# EAGLE design Vario Kobo (EAGLE 7.3.0)

## Sheet 1 of 2: Alimentation
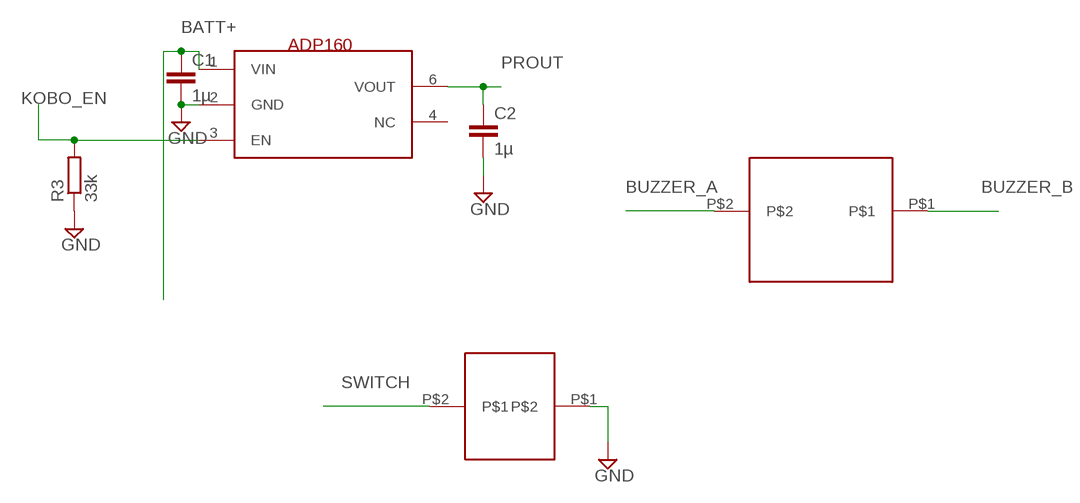
[diagram p0: schematic, sheet 1]

### Parts
ADP160  ADP160/161/162/163  [TSOT23-6_DDC]
BUTTON  SMS_J_LEAD  [SMS_J_LEAD]
BUZZER  PKLCS1212E2000-R1  [PKLCS1212E2000-R1-SMD]
C1  1µ  C-EUC0603  [C0603]
C2  1µ  C-EUC0603  [C0603]
R3  33k  R-EU_R0603  [R0603]

### Nets
BATT+: ADP160.1(VIN) C1.1 ; also sheet 2
BUZZER_A: BUZZER.P$2 ; also sheet 2
BUZZER_B: BUZZER.P$1 ; also sheet 2
GND: ADP160.2(GND) BUTTON.P$1 C1.2 C2.2 R3.1 ; also sheet 2
KOBO_EN: ADP160.3(EN) R3.2 ; also sheet 2
PROUT: ADP160.6(VOUT) C2.1 ; also sheet 2
SWITCH: BUTTON.P$2 ; also sheet 2
Unconnected: ADP160.4(NC)

## Sheet 2 of 2: Vario Core
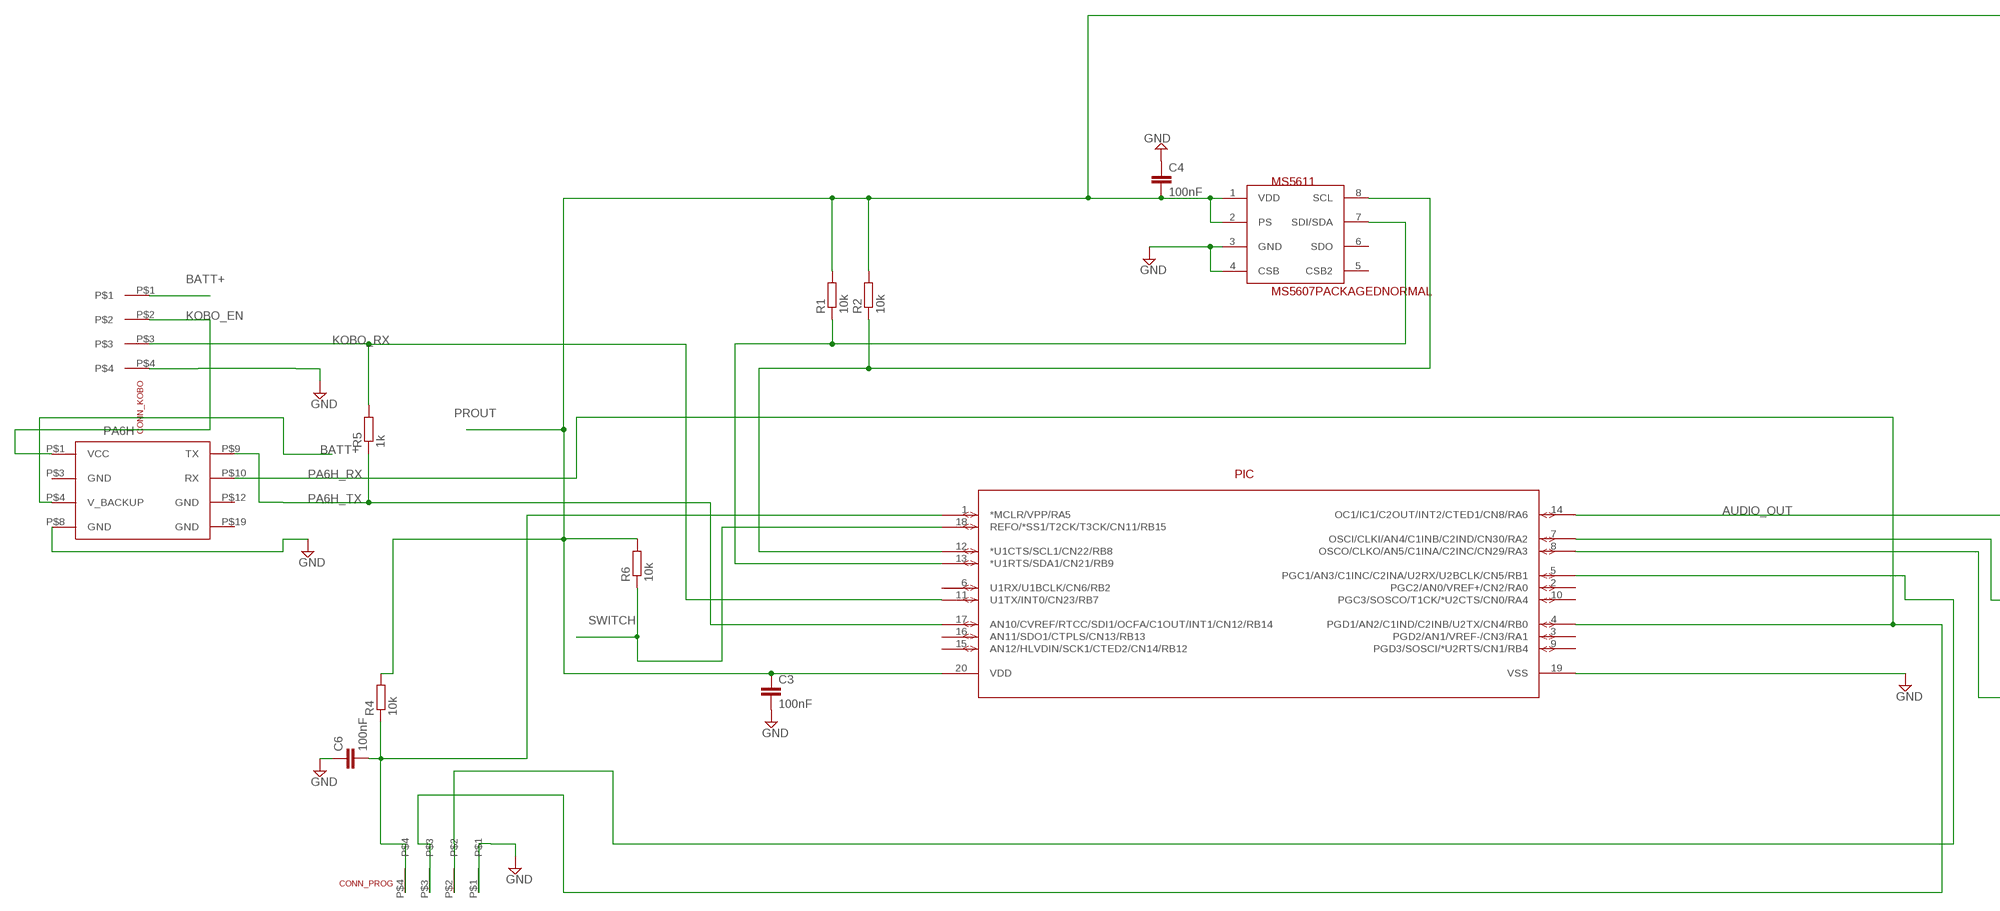
[diagram p1: schematic, sheet 2, part 1 of 2]
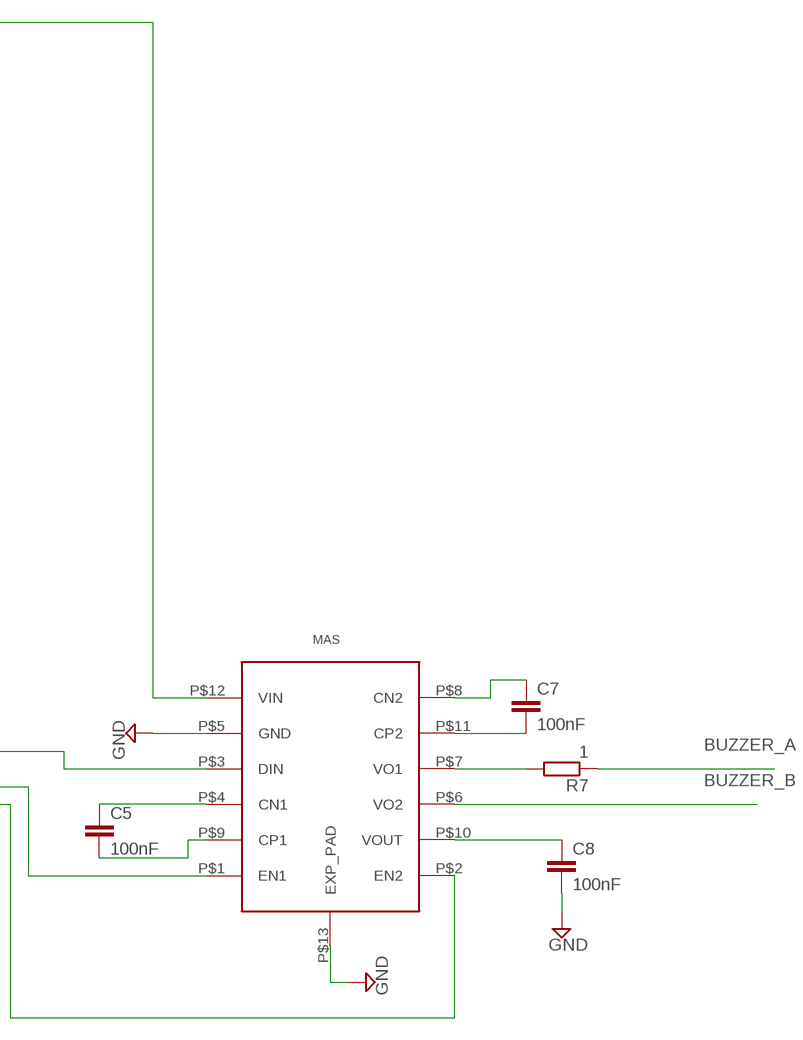
[diagram p2: schematic, sheet 2, part 2 of 2]

### Parts
C3  100nF  C-EUC0603  [C0603]
C4  100nF  C-EUC0603  [C0603]
C5  100nF  C-EUC0603  [C0603]
C6  100nF  C-EUC0603  [C0603]
C7  100nF  C-EUC0603  [C0603]
C8  100nF  C-EUC0603  [C0603]
CONN_KOBO  PICO-EZMATE4  [PICO-EZMATE4-PCB]
CONN_PROG  PICO-EZMATE4  [PICO-EZMATE4-PCB]
MAS  MAS6240  [QFN12_3X3_LONGPADS]
MS5611  MS5607PACKAGEDNORMAL  [MS5607-02BA03]
PA6H  PA6H  [PA6H_PRINT]
PIC  PIC24F16KA101-X_  [SSOP20_MC]
R1  10k  R-EU_R0603  [R0603]
R2  10k  R-EU_R0603  [R0603]
R4  10k  R-EU_R0603  [R0603]
R5  1k  R-EU_R0603  [R0603]
R6  10k  R-EU_R0603  [R0603]
R7  1  R-EU_R0603  [R0603]

### Nets
AUDIO_OUT: MAS.P$3(DIN) PIC.14(OC1/IC1/C2OUT/INT2/CTED1/CN8/RA6)
BATT+: CONN_KOBO.P$1 PA6H.P$4(V_BACKUP) ; also sheet 1
BUZZER_A: R7.1 ; also sheet 1
BUZZER_B: MAS.P$6(VO2) ; also sheet 1
GND: C3.2 C4.1 C6.1 C8.2 CONN_KOBO.P$4 CONN_PROG.P$1 MAS.P$5(GND) MAS.P$13(EXP_PAD) MS5611.3(GND) MS5611.4(CSB) PA6H.P$8(GND) PIC.19(VSS) ; also sheet 1
KOBO_EN: CONN_KOBO.P$2 PA6H.P$1(VCC) ; also sheet 1
KOBO_RX: CONN_KOBO.P$3 PIC.11(U1TX/INT0/CN23/RB7) R5.2
MCLR: C6.2 CONN_PROG.P$4 PIC.1(*MCLR/VPP/RA5) R4.1
N$3: C8.1 MAS.P$10(VOUT)
N$4: C5.1 MAS.P$4(CN1)
N$5: C5.2 MAS.P$9(CP1)
N$6: C7.2 MAS.P$11(CP2)
N$7: C7.1 MAS.P$8(CN2)
N$8: MAS.P$7(VO1) R7.2
N$9: MAS.P$1(EN1) PIC.7(OSCI/CLKI/AN4/C1INB/C2IND/CN30/RA2)
N$11: MAS.P$2(EN2) PIC.8(OSCO/CLKO/AN5/C1INA/C2INC/CN29/RA3)
PA6H_RX: CONN_PROG.P$3 PA6H.P$10(RX) PIC.4(PGD1/AN2/C1IND/C2INB/U2TX/CN4/RB0)
PA6H_TX: PA6H.P$9(TX) PIC.17(AN10/CVREF/RTCC/SDI1/OCFA/C1OUT/INT1/CN12/RB14) R5.1
PGC: CONN_PROG.P$2 PIC.5(PGC1/AN3/C1INC/C2INA/U2RX/U2BCLK/CN5/RB1)
PROUT: C3.1 C4.2 MAS.P$12(VIN) MS5611.1(VDD) MS5611.2(PS) PIC.20(VDD) R1.2 R2.2 R4.2 R6.2 ; also sheet 1
SCL: MS5611.8(SCL) PIC.12(*U1CTS/SCL1/CN22/RB8) R2.1
SDA: MS5611.7(SDI/SDA) PIC.13(*U1RTS/SDA1/CN21/RB9) R1.1
SWITCH: PIC.18(REFO/*SS1/T2CK/T3CK/CN11/RB15) R6.1 ; also sheet 1
Unconnected: MS5611.5(CSB2) MS5611.6(SDO) PA6H.P$3(GND) PA6H.P$12(GND) PA6H.P$19(GND) PIC.2(PGC2/AN0/VREF+/CN2/RA0) PIC.3(PGD2/AN1/VREF-/CN3/RA1) PIC.6(U1RX/U1BCLK/CN6/RB2) PIC.9(PGD3/SOSCI/*U2RTS/CN1/RB4) PIC.10(PGC3/SOSCO/T1CK/*U2CTS/CN0/RA4) PIC.15(AN12/HLVDIN/SCK1/CTED2/CN14/RB12) PIC.16(AN11/SDO1/CTPLS/CN13/RB13)

## Library data of the parts
ADP160 = analog-devices:ADP160/161/162/163: LDO, low Iq Linear Voltage Regulator
BUTTON = schurter:SMS_J_LEAD
BUZZER = murata_buzzers:PKLCS1212E2000-R1
C1-C8 = rcl:C-EU: CAPACITOR, European symbol
CONN_KOBO CONN_PROG = molex:PICO-EZMATE4
MAS = mas:MAS6240
MS5611 = measurement_specialties:MS5607PACKAGED
PA6H = gtop:PA6H
PIC = microchip:PIC24F16KA101-X_
R1-R7 = rcl:R-EU_: RESISTOR, European symbol

## Board
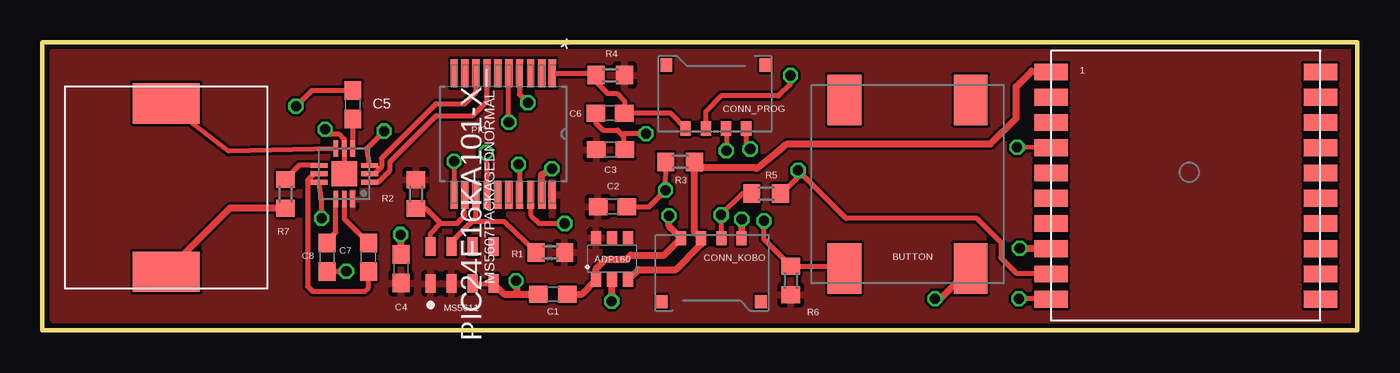
[diagram p3: board, top side]
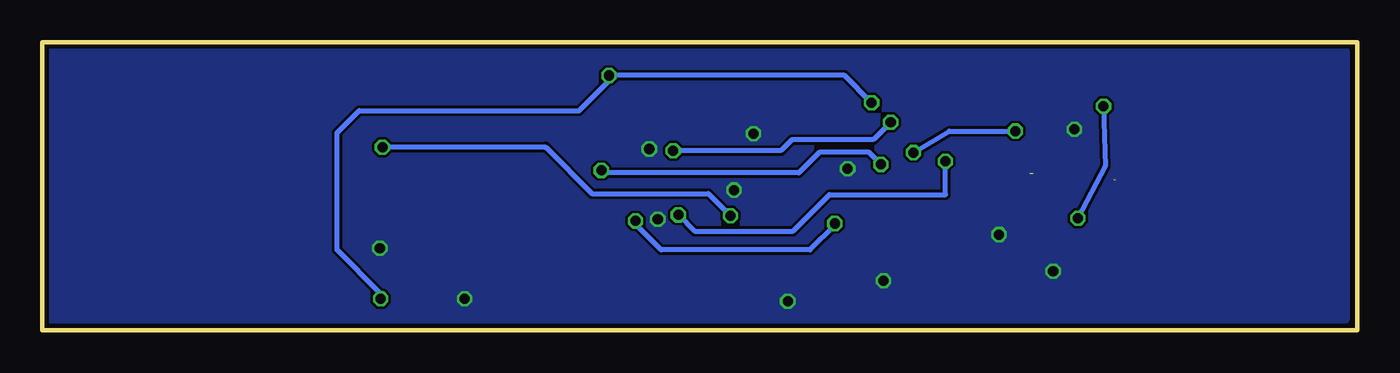
[diagram p4: board, bottom side, seen from below]

Size 78.14 x 17.12 mm. Coordinates in mm from the lower left corner, seen from the top.
Outline: 0,17.12 78.14,17.12 78.14,0 0,0 0,17.07
Copper layers (1*16): Top 0.035mm / dielectric 1.5mm / Bottom 0.035mm
Design rules "default": minimum track width 6mil, minimum drill 12mil, track to track 6mil, track to pad 6mil, pad to pad 6mil, via to via 6mil, smd to smd 0mil, copper to edge 10mil, drill to drill 10mil, minimum pad ring 10mil, minimum via ring 6mil, stop-mask expansion 2mil, vias tented up to drill 100mil, thermal gap 10mil

### Footprints (pad centres in the part's own frame; a part is rotated, then mirrored left to right if it is on the bottom)
TSOT23-6_DDC = smd 0.6 x 0.8: 1 -0.95,-1.25; 2 0,-1.25; 3 0.95,-1.25; 4 0.95,1.25; 5 0,1.25; 6 -0.95,1.25
SMS_J_LEAD = smd 3 x 2: P$1 5,3.75; P$2 5,-3.75; P$3 -5,-3.75; P$4 -5,3.75
PKLCS1212E2000-R1-SMD = smd 2.4 x 4: P$1 5,0; P$2 -5,0
C0603 = smd 1.1 x 1: 1 -0.85,0; 2 0.85,0
PICO-EZMATE4-PCB = smd 0.6 x 0.85: P$1 -1.8,0; P$2 -0.6,0; P$3 0.6,0; P$4 1.8,0 | smd 0.7 x 0.8: P$5 2.95,-3.775; P$6 -2.95,-3.775
QFN12_3X3_LONGPADS = smd 0.28 x 1: P$1 -0.5,-1.5; P$2 0,-1.5; P$3 0.5,-1.5; P$7 0.5,1.5; P$8 0,1.5; P$9 -0.5,1.5 | smd 1 x 0.28: P$4 1.5,-0.5; P$5 1.5,0; P$6 1.5,0.5; P$10 -1.5,0.5; P$11 -1.5,0; P$12 -1.5,-0.5 | smd 1.5 x 1.5: P$13 0,0
MS5607-02BA03 = smd 1.1 x 0.6: 1 0,0; 2 0,-1.25; 3 0,-2.5; 4 0,-3.75; 5 2.2,-3.75; 6 2.2,-2.5; 7 2.2,-1.25; 8 2.2,0
PA6H_PRINT = smd 2 x 1: P$1 -8,6.75; P$2 -8,5.25; P$3 -8,3.75; P$4 -8,2.25; P$5 -8,0.75; P$6 -8,-0.75; P$7 -8,-2.25; P$8 -8,-3.75; P$9 -8,-5.25; P$10 -8,-6.75; P$11 8,-6.75; P$12 8,-5.25; P$13 8,-3.75; P$14 8,-2.25; P$15 8,-0.75; P$16 8,0.75; P$17 8,2.25; P$18 8,3.75; P$19 8,5.25; P$20 8,6.75
SSOP20_MC = smd 1.676 x 0.432: 1 -3.607,2.921; 2 -3.607,2.286; 3 -3.607,1.626; 4 -3.607,0.965; 5 -3.607,0.33; 6 -3.607,-0.33; 7 -3.607,-0.965; 8 -3.607,-1.626; 9 -3.607,-2.286; 10 -3.607,-2.921; 11 3.607,-2.921; 12 3.607,-2.286; 13 3.607,-1.626; 14 3.607,-0.965; 15 3.607,-0.33; 16 3.607,0.33; 17 3.607,0.965; 18 3.607,1.626; 19 3.607,2.286; 20 3.607,2.921
R0603 = smd 1 x 1.1: 1 -0.85,0; 2 0.85,0

### Placement (x,y rotation side)
ADP160  33.86,4.25 0 top
BUTTON  51.42,8.69 270 top
BUZZER  7.37,8.49 90 top
C1  30.34,2.15 180 top
C2  33.89,7.34 0 top
C3  33.78,10.74 0 top
C4  21.33,3.66 270 top
C5  18.46,13.4 90 top
C6  33.73,12.9 0 top
C7  19.39,4.34 90 top
C8  16.93,4.35 270 top
CONN_KOBO  39.75,5.48 0 top
CONN_PROG  40.03,11.99 180 top
MAS  17.95,9.3 90 top
MS5611  23.08,2.78 90 top
PA6H  67.94,8.6 0 top
PIC  27.4,11.67 270 top
R1  30.2,4.63 0 top
R2  22.22,8.09 90 top
R3  37.9,10.01 0 top
R4  33.76,15.16 0 top
R5  43.01,8.13 180 top
R6  44.48,2.96 270 top
R7  14.47,8.11 90 top

### Tracks (layer width: path | path; a pad name or v marks a point on that pad's centre or on a via)
AUDIO_OUT  (via drill 0.6)
  Top 0.305: v26.38,10.56 PIC.14 | MAS.P$3 19.3,10.82 v20.32,11.84
  Bottom 0.305: v26.38,10.56 24.24,11.84 v20.32,11.84
BATT+  (via drill 0.6)
  Top 0.305: v57.92,10.87 57.94,10.9 PA6H.P$4
  Top 0.406: C1.1 32.06,2.15 ADP160.1 32.91,3.65 33.48,4.22 34.7,4.22 34.96,4.47 36.95,4.47 CONN_KOBO.P$1 37.24,6.19 v37.24,6.81
  Bottom 0.305: v37.24,6.81 38.56,8.13 45.47,8.13 48.24,10.9 48.27,10.87 v57.92,10.87
BUZZER_A
  Top 0.406: R7.1 11.15,7.26 BUZZER.P$2
BUZZER_B
  Top 0.305: MAS.P$6 11.07,10.65 BUZZER.P$1
GND  (via drill 0.6)
  Top 0.305: MAS.P$13 MAS.P$5 17.95,11.36 17.67,11.64 17.12,11.64 v16.81,11.94 | MS5611.3 MS5611.4 | C8.2 17.46,3.5 v18.07,3.51 | R3.1 v37.04,8.33 36.05,7.34 C2.2 | C6.1 32.88,12.34 33.33,11.89 34.19,11.89 34.55,11.53 | 34.55,11.53 34.55,10.81 C3.2 | v35.87,11.69 34.55,11.69 34.55,11.53 | CONN_PROG.P$1 41.83,11.01 v42.07,10.77
  Top 0.406: PIC.19 29.68,9.26 v30.28,9.6 | ADP160.2 33.84,2.98 v33.84,1.73 | v58.07,4.88 59.97,4.88 PA6H.P$8 | v53.04,1.88 53.36,1.88 BUTTON.P$1 | v41.56,6.61 CONN_KOBO.P$4 | v21.29,5.69 21.29,4.54 C4.1 | MS5611.4 27.45,2.15 28.2,2.15 | 28.2,2.15 C1.2 | v28.15,2.95 28.2,2.15
  pour Bottom: 0.67,16.61 0.67,0.61 77.67,0.61 77.67,16.61
KOBO_EN
  Top 0.406: ADP160.3 35.42,3.61 37.65,3.61 39.15,5.11 CONN_KOBO.P$2 38.75,5.88 R3.2 39.12,9.65 | 39.16,9.6 39.12,9.65 | PA6H.P$1 58.79,15.4 57.87,14.48 57.87,12.6 56.34,11.08 44.25,11.08 43.59,10.52 42.42,9.6 42.38,9.65 39.12,9.65
KOBO_RX  (via drill 0.6)
  Top 0.305: v24.47,10.04 PIC.11 | CONN_KOBO.P$3 40.35,6.85 v40.34,6.86 41.61,8.13 R5.2
  Bottom 0.305: v40.34,6.86 39.38,5.89 33.53,5.89 31.37,8.06 PIC.11 v24.47,10.04
MCLR
  Top 0.305: 30.32,15.68 PIC.1 32.38,15.27 R4.1 32.91,14.75 33.58,14.07 34.14,14.07 34.6,13.62 34.6,12.91 | 34.6,12.91 C6.2 | 34.6,12.91 37.3,12.91 CONN_PROG.P$4
N$3
  Top 0.305: C8.1 16.83,5.2 17.45,5.82 MAS.P$10
N$4
  Top 0.305: C5.1 18.45,12.54 MAS.P$4
N$5  (via drill 0.6)
  Top 0.305: v16.6,6.66 16.6,7.67 MAS.P$9 | C5.2 16.02,14.25 v15.08,13.31
  Bottom 0.305: v15.08,13.31 14.98,9.76 v16.6,6.66
N$6
  Top 0.305: MAS.P$11 17.95,6.63 C7.2
N$7
  Top 0.305: C7.1 19.39,2.54 19.17,2.31 16.07,2.31 15.77,2.61 15.77,8.91 16.16,9.3 MAS.P$8
N$8  (1 unrouted)
  Top 0.305: MAS.P$7 15.26,9.8 14.37,8.91
N$9
  Top 0.305: 26.42,15.29 26.43,15.29 PIC.7 26.42,13.62 25.56,12.75 23.41,12.75 20.67,10.01 20.67,9.51 19.96,8.8 MAS.P$1
N$11  (1 unrouted)
  Top 0.305: PIC.8 25.77,14.13 25.1,13.46 23.42,13.46 20.17,10.21 20.17,9.71 19.77,9.31 19.27,9.31
PA6H_RX  (via drill 0.6)
  Top 0.305: PIC.4 28.36,14.01 v28.86,13.51 | CONN_PROG.P$3 39.43,13.01 40.34,13.92 43.74,13.92 44.46,14.63 v44.46,15.14 | PA6H.P$10 59.98,1.88 v58.02,1.88
  Bottom 0.305: v28.86,13.51 30.49,15.14 v44.46,15.14 44.46,14.84 46.23,13.06 59.29,13.06 60.61,11.74 60.61,4.78 58.02,2.19 v58.02,1.88
PA6H_TX  (via drill 0.6)
  Top 0.305: PIC.17 28.36,9.8 v28.3,9.86 | PA6H.P$9 59.98,3.41 57.87,3.41 56.95,4.32 56.95,5.23 55.53,6.66 47.76,6.66 v44.91,9.5 44.91,9.1 44.1,8.28 44.01,8.28 R5.1
  Bottom 0.305: v28.3,9.86 29.01,10.57 31.96,10.57 33.18,9.35 44.91,9.35 v44.91,9.5
PGC  (via drill 0.6)
  Top 0.305: CONN_PROG.P$2 40.65,11.99 v40.65,10.67 | v27.73,12.36 PIC.5
  Bottom 0.305: v27.73,12.36 28.76,11.33 33.58,11.33 34.25,10.67 v40.65,10.67
PROUT
  pour Top: 0.67,16.61 77.67,16.61 77.67,0.61 0.67,0.61
SCL
  Top 0.305: MS5611.8 23.08,5.75 23.68,6.35 | 23.68,6.35 24.64,6.35 25.1,6.81 PIC.12 | R2.1 22.79,7.24 23.68,6.35
SDA
  Top 0.305: MS5611.7 24.33,5.27 25.51,6.45 | 25.51,6.45 25.77,6.72 PIC.13 | R1.1 27.43,6.45 25.51,6.45
SWITCH  (via drill 0.6)
  Top 0.305: BUTTON.P$2 47.54,3.81 R6.1 42.88,5.41 v42.88,6.5 | PIC.18 29.02,6.85 29.52,6.35 v31.04,6.35
  Bottom 0.305: v31.04,6.35 31.04,6.25 32.52,4.78 41.36,4.78 42.88,6.3 v42.88,6.5

### Text on the board
tNames: 1